# EAGLE design uc4h cube carrier v0310r (EAGLE 7.5.0)
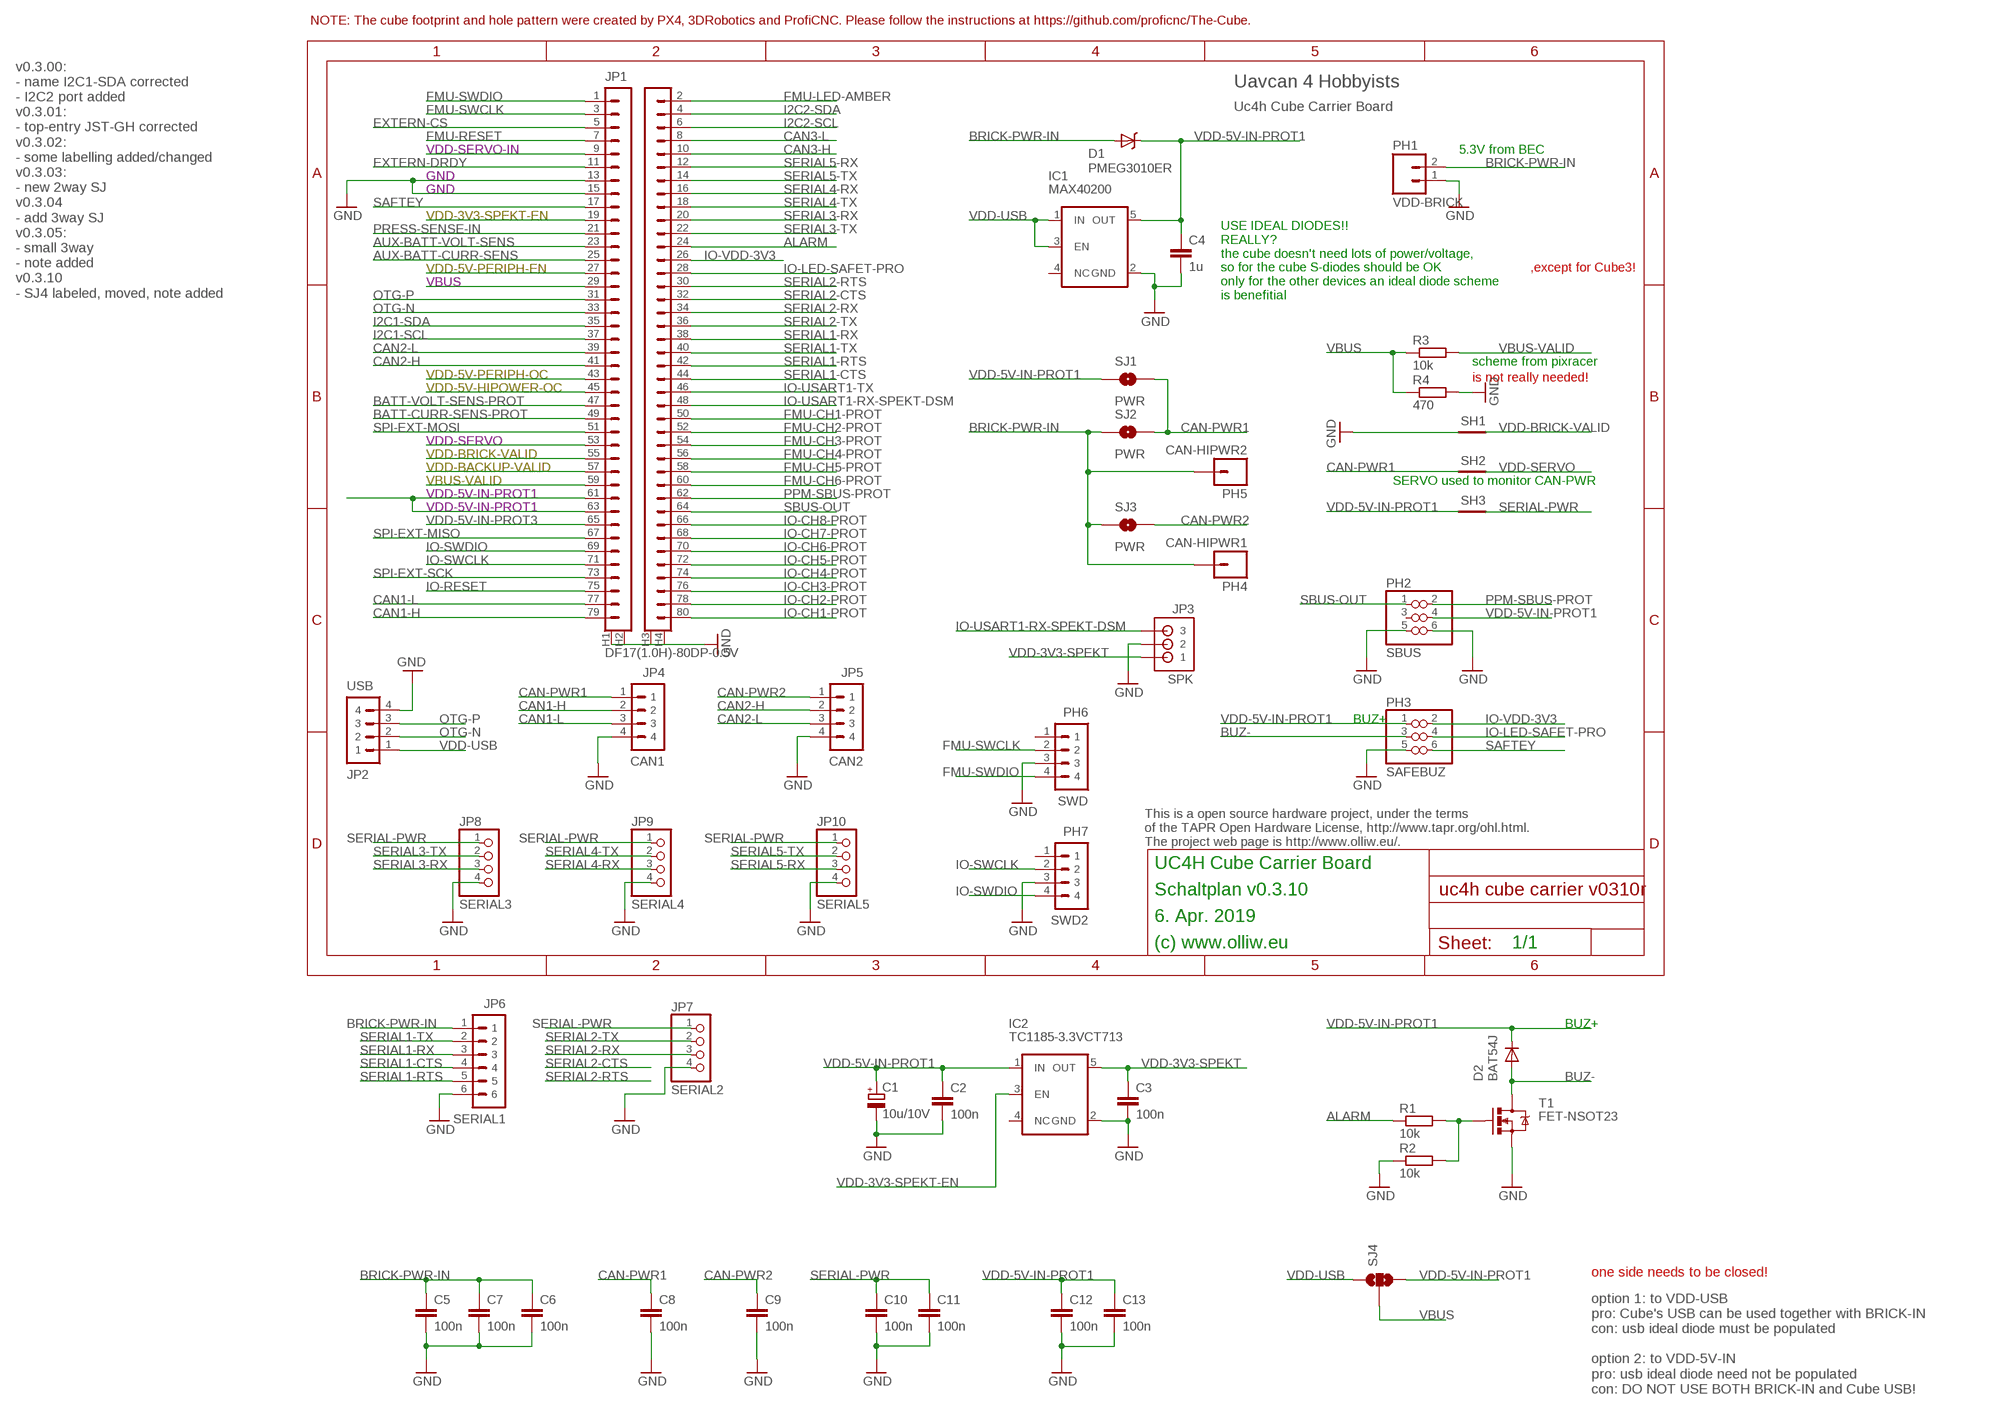
[diagram p0: schematic, sheet 1]

## Parts
C1  10u/10V  CPOL-EUSMCA  [SMC_A]
C2  100n  C-EUC0603  [C0603]
C3  100n  C-EUC0603  [C0603]
C4  1u  C-EUC0603  [C0603]
C5  100n  C-EUC0603  [C0603]
C6  100n  C-EUC0603  [C0603]
C7  100n  C-EUC0402  [C0402]
C8  100n  C-EUC0603  [C0603]
C9  100n  C-EUC0603  [C0603]
C10  100n  C-EUC0603  [C0603]
C11  100n  C-EUC0603  [C0603]
C12  100n  C-EUC0603  [C0603]
C13  100n  C-EUC0603  [C0603]
D1  PMEG3010ER  DIODE-SCHOTTKYSOD123-W  [SOD123W-DIODE]
D2  BAT54J  DIODE-SOD110-R  [SOD110-R]
IC1  MAX40200  V_REG_TPS76433SOT23-5  [SOT23-5]
IC2  TC1185-3.3VCT713  V_REG_TPS76433SOT23-5  [SOT23-5]
JP1  DF17(1.0H)-80DP-0.5V  PIX-CUBE-VIA  [PIX-CUBE-DF17(1.0H)-80DP-0.5V-VIA]
JP2  USB  JST-GH-4TOP-ENTRY  [BM04B-GHS-TBT]
JP3  SPK  B3B-ZR  [B3B-ZR]
JP4  CAN1  JST-GH-4TOP-ENTRY  [BM04B-GHS-TBT]
JP5  CAN2  JST-GH-4TOP-ENTRY  [BM04B-GHS-TBT]
JP6  SERIAL1  JST-GH-6TOP-ENTRY  [BM06B-GHS-TBT]
JP7  SERIAL2  PINHEAD_4X1  [PINHEAD_4X1]
JP8  SERIAL3  PINHEAD_4X1  [PINHEAD_4X1]
JP9  SERIAL4  PINHEAD_4X1  [PINHEAD_4X1]
JP10  SERIAL5  PINHEAD_4X1  [PINHEAD_4X1]
PH1  VDD-BRICK  M02PTH  [1X02]
PH2  SBUS  PINHEAD_3X2  [PINHEAD_3X2]
PH3  SAFEBUZ  PINHEAD_3X2  [PINHEAD_3X2]
PH4  CAN-HIPWR1  M01PTH  [1X01]
PH5  CAN-HIPWR2  M01PTH  [1X01]
PH6  SWD  P4X1_1P27-OCT_BILEX  [4X1_1P27_OCT_BILEX]
PH7  SWD2  P4X1_1P27-OCT_BILEX  [4X1_1P27_OCT_BILEX]
R1  10k  R-EU_R0402  [R0402]
R2  10k  R-EU_R0402  [R0402]
R3  10k  R-EU_R0402  [R0402]
R4  470  R-EU_R0402  [R0402]
SH1  SHORT-HT5  [SHORT_TOP-50]
SH2  SHORT-HT5  [SHORT_TOP-50]
SH3  SHORT-HT5  [SHORT_TOP-50]
SJ1  PWR  SJ-2WAY-WPASTECONNECT  [SJ-2WAY-BIG-WPASTEC]
SJ2  PWR  SJ-2WAY-STANDARD  [SJ-2WAY-BIG]
SJ3  PWR  SJ-2WAY-WPASTECONNECT  [SJ-2WAY-BIG-WPASTEC]
SJ4  SJ-3WAY-03  [SJ-3WAY-WPASTEC]
T1  FET-NSOT23  [SOT23]

## Nets
ALARM: JP1.24 R1.1
AUX-BATT-CURR-SENS: JP1.25
AUX-BATT-VOLT-SENS: JP1.23
BATT-CURR-SENS-PROT: JP1.49
BATT-VOLT-SENS-PROT: JP1.47
BRICK-PWR-IN: C5.1 C6.1 C7.1 D1.A JP6.1 PH1.2 PH4.1 PH5.1 SJ2.1 SJ3.1
BUZ-: D2.A PH3.3 T1.3(D)
CAN1-H: JP1.79 JP4.2
CAN1-L: JP1.77 JP4.3
CAN2-H: JP1.41 JP5.2
CAN2-L: JP1.39 JP5.3
CAN3-H: JP1.10
CAN3-L: JP1.8
CAN-PWR1: C8.1 JP4.1 SH2.1 SJ1.2 SJ2.2
CAN-PWR2: C9.1 JP5.1 SJ3.2
EXTERN-CS: JP1.5
EXTERN-DRDY: JP1.11
FMU-CH1-PROT: JP1.50
FMU-CH2-PROT: JP1.52
FMU-CH3-PROT: JP1.54
FMU-CH4-PROT: JP1.56
FMU-CH5-PROT: JP1.58
FMU-CH6-PROT: JP1.60
FMU-LED-AMBER: JP1.2
FMU-RESET: JP1.7
FMU-SWCLK: JP1.3 PH6.2
FMU-SWDIO: JP1.1 PH6.4
GND: C1.- C2.2 C3.2 C4.2 C5.2 C6.2 C7.2 C8.2 C9.2 C10.2 C11.2 C12.2 C13.2 IC1.2(GND) IC2.2(GND) JP1.13 JP1.15 JP1.H1 JP1.H2 JP1.H3 JP1.H4 JP2.4 JP3.2 JP4.4 JP5.4 JP6.6 JP7.4 JP8.4 JP9.4 JP10.4 PH1.1 PH2.5 PH2.6 PH3.5 PH6.3 PH7.3 R2.1 R4.2 SH1.1 T1.2(S)
I2C1-SCL: JP1.37
I2C1-SDA: JP1.35
I2C2-SCL: JP1.6
I2C2-SDA: JP1.4
IO-CH1-PROT: JP1.80
IO-CH2-PROT: JP1.78
IO-CH3-PROT: JP1.76
IO-CH4-PROT: JP1.74
IO-CH5-PROT: JP1.72
IO-CH6-PROT: JP1.70
IO-CH7-PROT: JP1.68
IO-CH8-PROT: JP1.66
IO-LED-SAFET-PRO: JP1.28 PH3.4
IO-RESET: JP1.75
IO-SWCLK: JP1.71 PH7.2
IO-SWDIO: JP1.69 PH7.4
IO-USART1-RX-SPEKT-DSM: JP1.48 JP3.3
IO-USART1-TX: JP1.46
IO-VDD-3V3: JP1.26 PH3.2
N$1: R1.2 R2.2 T1.1(G)
OTG-N: JP1.33 JP2.2
OTG-P: JP1.31 JP2.3
PPM-SBUS-PROT: JP1.62 PH2.2
PRESS-SENSE-IN: JP1.21
SAFTEY: JP1.17 PH3.6
SBUS-OUT: JP1.64 PH2.1
SERIAL1-CTS: JP1.44 JP6.4
SERIAL1-RTS: JP1.42 JP6.5
SERIAL1-RX: JP1.38 JP6.3
SERIAL1-TX: JP1.40 JP6.2
SERIAL2-CTS: JP1.32
SERIAL2-RTS: JP1.30
SERIAL2-RX: JP1.34 JP7.3
SERIAL2-TX: JP1.36 JP7.2
SERIAL3-RX: JP1.20 JP8.3
SERIAL3-TX: JP1.22 JP8.2
SERIAL4-RX: JP1.16 JP9.3
SERIAL4-TX: JP1.18 JP9.2
SERIAL5-RX: JP1.12 JP10.3
SERIAL5-TX: JP1.14 JP10.2
SERIAL-PWR: C10.1 C11.1 JP7.1 JP8.1 JP9.1 JP10.1 SH3.2
SPI-EXT-MISO: JP1.67
SPI-EXT-MOSI: JP1.51
SPI-EXT-SCK: JP1.73
VBUS: JP1.29 R3.1 R4.1 SJ4.2
VBUS-VALID: JP1.59 R3.2
VDD-3V3-SPEKT: C3.1 IC2.5(OUT) JP3.1
VDD-3V3-SPEKT-EN: IC2.3(EN) JP1.19
VDD-5V-HIPOWER-OC: JP1.45
VDD-5V-IN-PROT1: C1.+ C2.1 C4.1 C12.1 C13.1 D1.C D2.C IC1.5(OUT) IC2.1(IN) JP1.61 JP1.63 PH2.4 PH3.1 SH3.1 SJ1.1 SJ4.3
VDD-5V-IN-PROT3: JP1.65
VDD-5V-PERIPH-EN: JP1.27
VDD-5V-PERIPH-OC: JP1.43
VDD-BACKUP-VALID: JP1.57
VDD-BRICK-VALID: JP1.55 SH1.2
VDD-SERVO: JP1.53 SH2.2
VDD-SERVO-IN: JP1.9
VDD-USB: IC1.1(IN) IC1.3(EN) JP2.1 SJ4.1
Unconnected: IC1.4(NC) IC2.4(NC) PH2.3 PH6.1 PH7.1

## Notes on the sheet
- NOTE: The cube footprint and hole pattern were created by PX4, 3DRobotics and ProfiCNC. Please follow the instructions at https://github.com/proficnc/The-Cube.
- v0.3.00:
  - name I2C1-SDA corrected
  - I2C2 port added
  v0.3.01:
  - top-entry JST-GH corrected
  v0.3.02:
  - some labelling added/changed
  v0.3.03:
  - new 2way SJ
  v0.3.04
  - add 3way SJ
  v0.3.05:
  - small 3way
  - note added
  v0.3.10
  - SJ4 labeled, moved, note added
- Uavcan 4 Hobbyists
- Uc4h Cube Carrier Board
- 5.3V from BEC
- ,except for Cube3!
- USE IDEAL DIODES!!
  REALLY?
  the cube doesn't need lots of power/voltage,
  so for the cube S-diodes should be OK
  only for the other devices an ideal diode scheme
  is benefitial
- scheme from pixracer
- is not really needed!
- SERVO used to monitor CAN-PWR
- BUZ+
- This is a open source hardware project, under the terms
  of the TAPR Open Hardware License, http://www.tapr.org/ohl.html.
  The project web page is http://www.olliw.eu/.
- UC4H Cube Carrier Board
- Schaltplan v0.3.10
- 6. Apr. 2019
- (c) www.olliw.eu | 1/1
- BUZ+
- one side needs to be closed!
- option 1: to VDD-USB
  pro: Cube's USB can be used together with BRICK-IN
  con: usb ideal diode must be populated
  
  option 2: to VDD-5V-IN
  pro: usb ideal diode need not be populated
  con: DO NOT USE BOTH BRICK-IN and Cube USB!

## Library data of the parts
C1 = rcl:CPOL-EU: POLARIZED CAPACITOR, European symbol
C2-C13 = rcl:C-EU: CAPACITOR, European symbol
D1 = # stdlib:DIODE-SCHOTTKY
D2 = diode:DIODE-: DIODE
IC1 IC2 = # SparkFun2:V_REG_TPS76433: Voltage Regulator Older TI part. LDO 150mA regulator. No output by-pass cap option. See V_REG_LDO for a better part.
JP1 = # stdlib:PIX-CUBE
JP2 JP4 JP5 = # stdlib:JST-GH-4
JP3 = # jst:B3B-ZR: JST-ZH Connector 3 pol, 1.5mm pitch Package: B3B-ZR Source: http://www.jst-mfg.com/product/pdf/eng/eZH.pdf
JP6 = # stdlib:JST-GH-6
JP7-JP10 = # stdlib:PINHEAD_4X1
PH1 = # SparkFun2:M02: Header 2 Standard 2-pin 0.1" header. Use with straight break away headers (SKU : PRT-00116), right angle break away headers (PRT-00553), swiss pins (PRT-00743), machine pins (PRT-00117), and female headers (PRT-00115). Molex polarized connector foot print use with SKU : PRT-08233 with associated crimp pins and housings.
PH2 PH3 = # stdlib:PINHEAD_3X2
PH4 PH5 = # SparkFun:M01: Header 1 Standard 1-pin 0.1" header. Use with straight break away headers (SKU : PRT-00116), right angle break away headers (PRT-00553), swiss pins (PRT-00743), machine pins (PRT-00117), and female headers (PRT-00115).
PH6 PH7 = # stdlib:P4X1_1P27
R1-R4 = rcl:R-EU_: RESISTOR, European symbol
SH1-SH3 = shorts:SHORT-H: Short between two nets; BOM: no
SJ1-SJ3 = # stdlib:SJ-2WAY
SJ4 = # stdlib:SJ-3WAY
T1 = # stdlib:FET-N

## Board
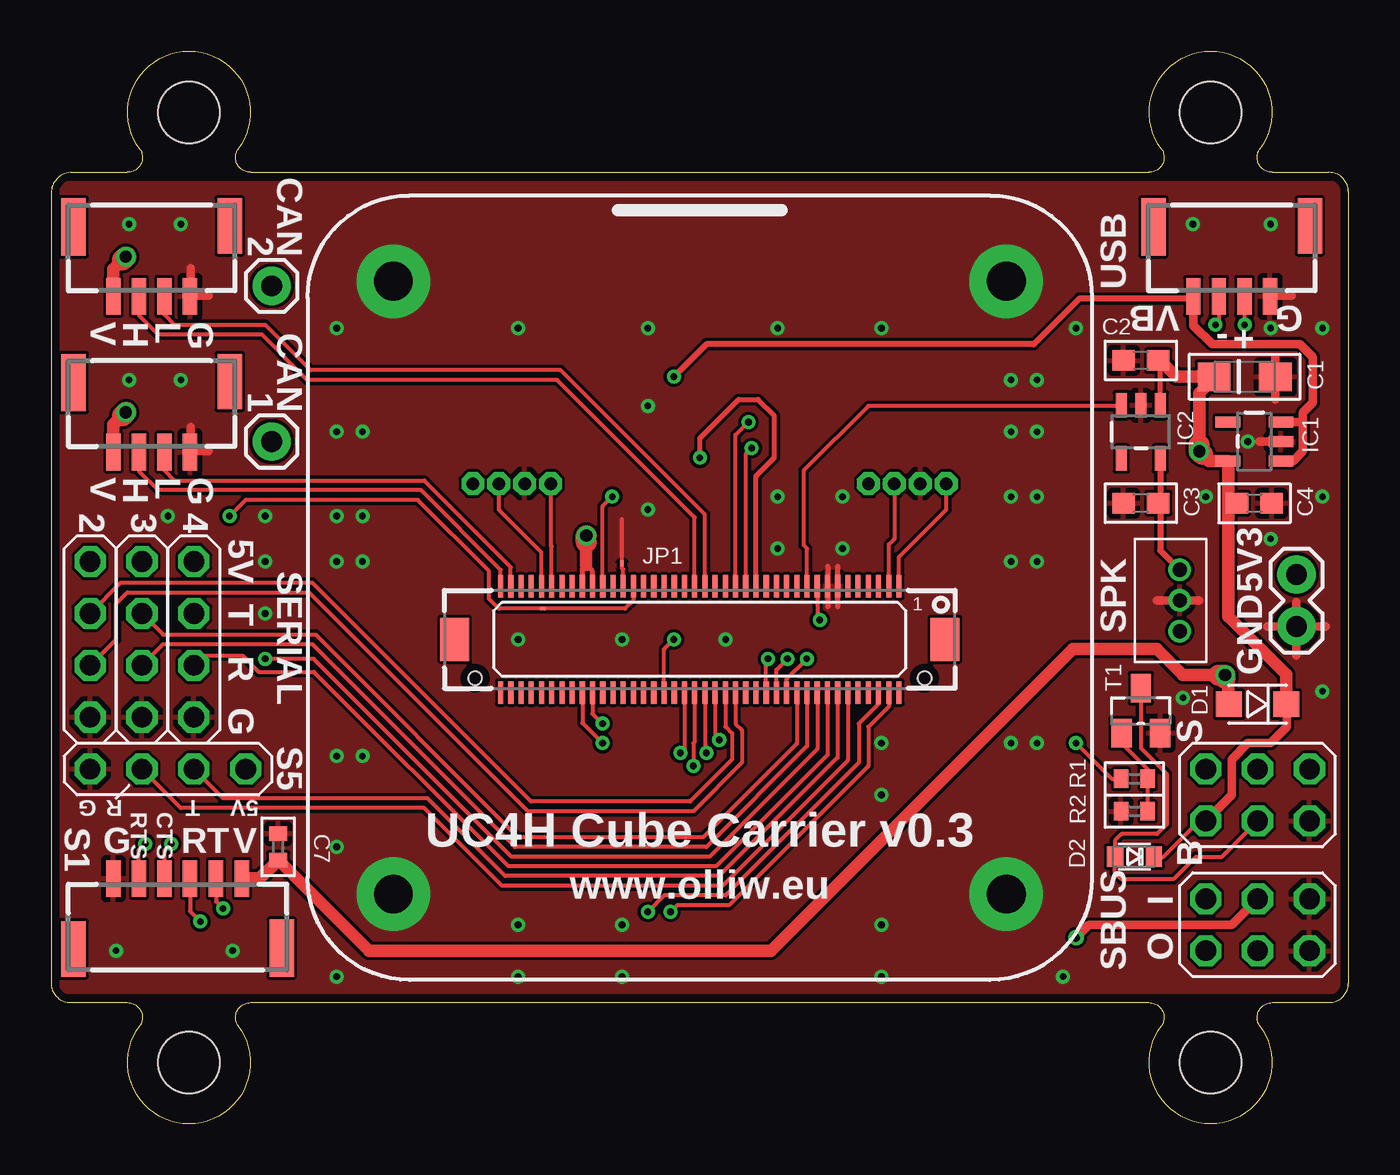
[diagram p1: board, top side]
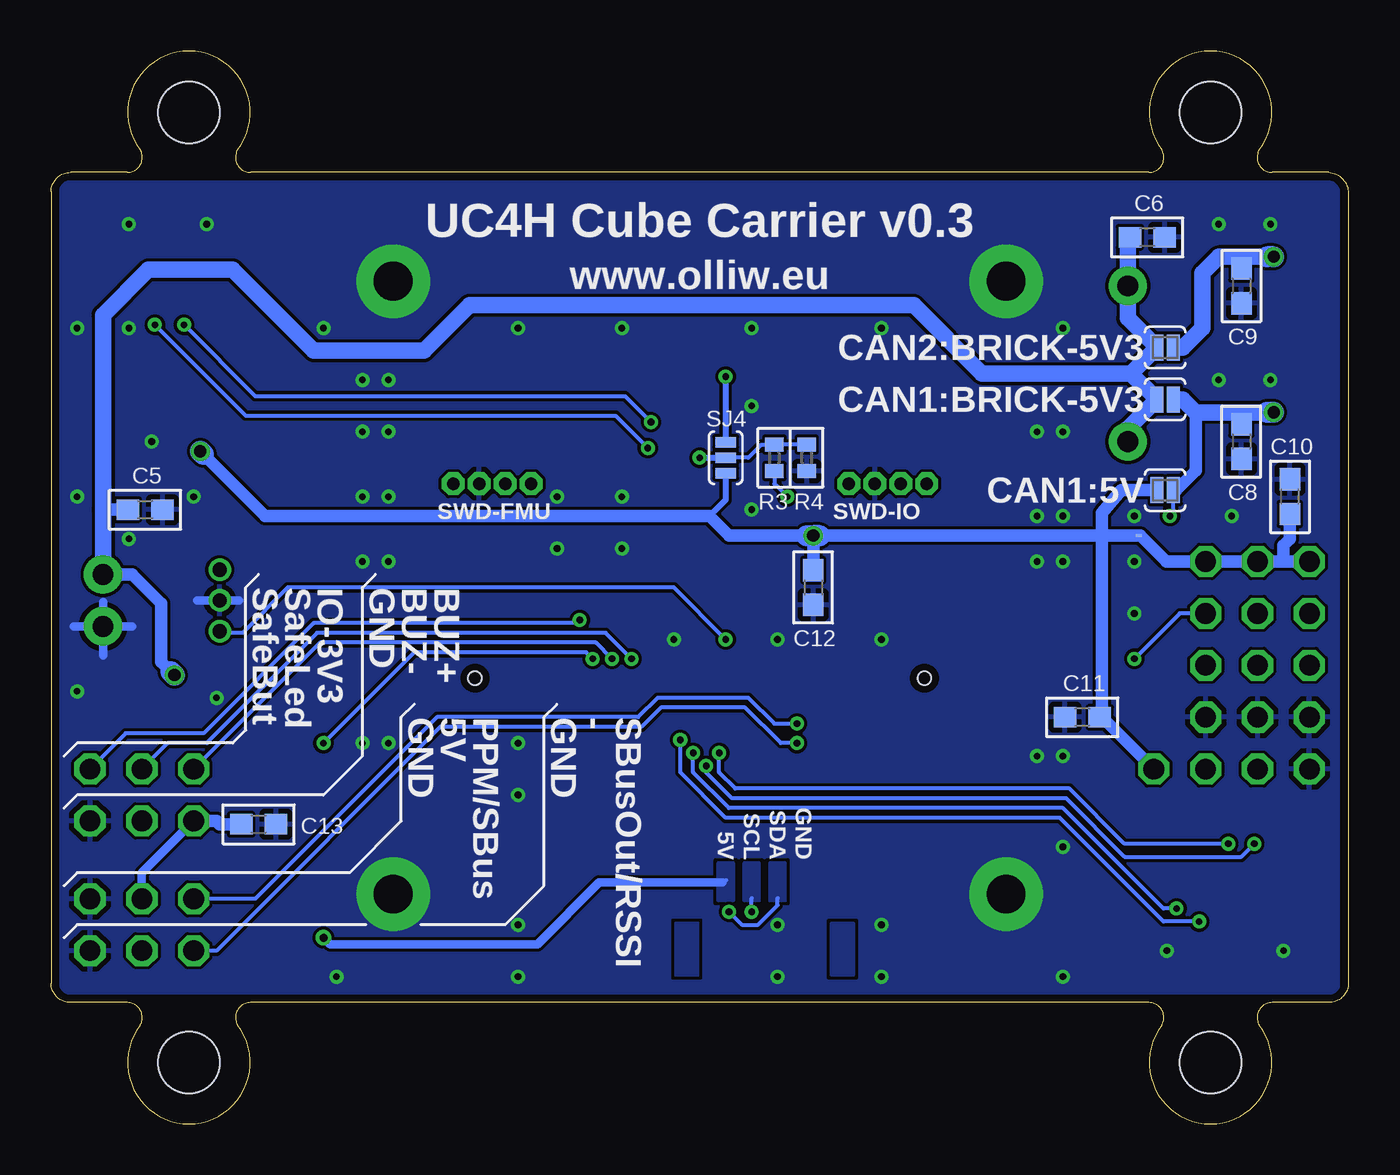
[diagram p2: board, bottom side, seen from below]

Size 63.5 x 52.51 mm. Coordinates in mm from the lower left corner, seen from the top.
Outline: 0.95,5.94 3.73,5.94 arc-120 4.37,4.83 arc255 9.13,4.83 arc-120 9.77,5.94 53.74,5.94 arc-120 54.37,4.83 arc255 59.14,4.83 arc-120 59.77,5.94 62.55,5.94 arc90 63.5,6.89 63.5,45.62 arc90 62.55,46.58 59.77,46.58 arc-120 59.14,47.69 arc255 54.37,47.69 arc-120 53.74,46.58 9.77,46.58 arc-120 9.13,47.69 arc255 4.37,47.69 arc-120 3.73,46.58 0.95,46.58 arc90 0,45.47 0,6.89 arc90 0.95,5.94
Copper layers (1*16): Top 0.0356mm / dielectric 1.5011mm / Bottom 0.0356mm
Design rules "ow-oshpark-2layer": minimum track width 6mil, minimum drill 13mil, track to track 6mil, track to pad 6mil, pad to pad 6mil, via to via 6mil, smd to smd 6mil, copper to edge 15mil, drill to drill 6mil, minimum pad ring 7mil, minimum via ring 7mil, stop-mask expansion 2.5mil, vias tented up to drill 26mil, thermal gap 10mil
Holes 3 mm at 6.75,49.51 56.76,49.51 56.76,3 6.75,3

### Footprints (pad centres in the part's own frame; a part is rotated, then mirrored left to right if it is on the bottom)
SMC_A = smd 1.6 x 1.4: + -1.5,0; - 1.5,0
C0603 = smd 1.1 x 1: 1 -0.85,0; 2 0.85,0
C0402 = smd 0.7 x 0.9: 1 -0.65,0; 2 0.65,0
SOD123W-DIODE = smd 1.27 x 1.27: A -1.4,0; C 1.4,0
SOD110-R = smd 0.8 x 1: A 0.95,0; C -0.95,0
SOT23-5 = smd 0.55 x 1.2: 1 -0.95,-1.3; 2 0,-1.3; 3 0.95,-1.3; 4 0.95,1.3; 5 -0.95,1.3
PIX-CUBE-DF17(1.0H)-80DP-0.5V-VIA = smd 0.25 x 1.1: 1 9.75,2.6; 2 9.75,-2.6; 3 9.25,2.6; 4 9.25,-2.6; 5 8.75,2.6; 6 8.75,-2.6; 7 8.25,2.6; 8 8.25,-2.6; 9 7.75,2.6; 10 7.75,-2.6; 11 7.25,2.6; 12 7.25,-2.6; 13 6.75,2.6; 14 6.75,-2.6; 15 6.25,2.6; 16 6.25,-2.6; 17 5.75,2.6; 18 5.75,-2.6; 19 5.25,2.6; 20 5.25,-2.6; 21 4.75,2.6; 22 4.75,-2.6; 23 4.25,2.6; 24 4.25,-2.6; 25 3.75,2.6; 26 3.75,-2.6; 27 3.25,2.6; 28 3.25,-2.6; 29 2.75,2.6; 30 2.75,-2.6; 31 2.25,2.6; 32 2.25,-2.6; 33 1.75,2.6; 34 1.75,-2.6; 35 1.25,2.6; 36 1.25,-2.6; 37 0.75,2.6; 38 0.75,-2.6; 39 0.25,2.6; 40 0.25,-2.6; 41 -0.25,2.6; 42 -0.25,-2.6; 43 -0.75,2.6; 44 -0.75,-2.6; 45 -1.25,2.6; 46 -1.25,-2.6; 47 -1.75,2.6; 48 -1.75,-2.6; 49 -2.25,2.6; 50 -2.25,-2.6; 51 -2.75,2.6; 52 -2.75,-2.6; 53 -3.25,2.6; 54 -3.25,-2.6; 55 -3.75,2.6; 56 -3.75,-2.6; 57 -4.25,2.6; 58 -4.25,-2.6; 59 -4.75,2.6; 60 -4.75,-2.6; 61 -5.25,2.6; 62 -5.25,-2.6; 63 -5.75,2.6; 64 -5.75,-2.6; 65 -6.25,2.6; 66 -6.25,-2.6; 67 -6.75,2.6; 68 -6.75,-2.6; 69 -7.25,2.6; 70 -7.25,-2.6; 71 -7.75,2.6; 72 -7.75,-2.6; 73 -8.25,2.6; 74 -8.25,-2.6; 75 -8.75,2.6; 76 -8.75,-2.6; 77 -9.25,2.6; 78 -9.25,-2.6; 79 -9.75,2.6; 80 -9.75,-2.6 | drill 1.9 pad 3.6: H1 -15,17.53; H2 -15,-12.47; H3 15,-12.47; H4 15,17.53 | smd 1.4 x 2.1: SIT1 12,0; SIT2 -12,0 | hole 0.65: -11,-1.9; 11,-1.9
BM04B-GHS-TBT = smd 0.7 x 1.8: 1 1.875,4.8; 2 0.625,4.8; 3 -0.625,4.8; 4 -1.875,4.8 | smd 1.2 x 2.7: FIT@1 -3.825,1.35 | smd 1.2 x 2.8: FIT@2 3.825,1.4
B3B-ZR = drill 0.7 pad 1.1: 1 -1.5,0; 2 0,0; 3 1.5,0
BM06B-GHS-TBT = smd 0.7 x 1.8: 1 3.145,4.8; 2 1.875,4.8; 3 0.605,4.8; 4 -0.645,4.8; 5 -1.895,4.8; 6 -3.145,4.8 | smd 1.2 x 2.7: FIT@1 -5.095,1.35 | smd 1.2 x 2.8: FIT@2 5.095,1.4
PINHEAD_4X1 = drill 1.016 octagon: 1 0,7.62; 2 0,5.08; 3 0,2.54; 4 0,0
1X02 = drill 1.016 pad 1.88: 1 0,0; 2 2.54,0
PINHEAD_3X2 = drill 1.016 octagon: 1 0,0; 2 2.54,0; 3 0,-2.54; 4 2.54,-2.54; 5 0,-5.08; 6 2.54,-5.08
1X01 = drill 1.016 pad 1.88: 1 0,0
4X1_1P27_OCT_BILEX = drill 0.61 pad 1.118 octagon: 1 0,0; 2 0,-1.27; 3 0,-2.54; 4 0,-3.81
R0402 = smd 0.7 x 0.9: 1 -0.65,0; 2 0.65,0
SHORT_TOP-50 = smd 0.152 x 0.152: 1 0,0; 2 0.127,0
SJ-2WAY-BIG-WPASTEC = smd 0.635 x 1.27: 1 -0.4,0; 2 0.413,0
SJ-2WAY-BIG = smd 0.635 x 1.27: 1 -0.4,0; 2 0.413,0
SJ-3WAY-WPASTEC = smd 0.508 x 1.016: 1 -0.762,0; 2 0,0; 3 0.762,0
SOT23 = smd 1 x 1.4: 1 -0.95,-1.1; 2 0.95,-1.1; 3 0,1.1

### Placement (x,y rotation side)
C1  58.42,36.58 0 top
C2  53.34,37.37 180 top
C3  53.34,30.38 180 top
C4  58.9,30.38 0 top
C5  58.9,30.07 0 bottom
C6  9.85,43.4 0 bottom
C7  11.12,13.56 90 top
C8  5.24,33.4 270 bottom
C9  5.24,41.02 270 bottom
C10  2.86,30.7 90 bottom
C11  13.02,19.91 180 bottom
C12  26.2,26.26 270 bottom
C13  53.34,14.67 0 bottom
D1  59.06,20.54 0 top
D2  53.03,13.08 180 top
IC1  58.9,33.4 90 top
IC2  53.34,33.88 180 top
JP1  31.75,23.72 0 top
JP2  57.79,45.31 180 top
JP3  55.25,25.62 270 top
JP4  4.92,37.69 180 top
JP5  4.92,45.31 180 top
JP6  6.19,7.21 0 top
JP7  1.91,19.91 0 top
JP8  4.45,19.91 0 top
JP9  6.99,19.91 0 top
JP10  1.91,17.37 270 top
PH1  60.96,24.35 90 top
PH2  56.52,8.48 90 top
PH3  56.52,14.83 90 top
PH4  10.8,33.4 0 top
PH5  10.8,41.02 0 top
PH6  40.01,31.34 90 top
PH7  20.64,31.34 90 top
R1  53.03,16.89 0 top
R2  53.03,15.3 0 top
R3  28.1,32.61 270 bottom
R4  26.51,32.61 270 bottom
SH1  27.94,27.37 90 top
SH2  24.13,25.23 180 top
SH3  10.32,28.8 0 bottom
SJ1  8.97,31.02 0 bottom
SJ2  8.97,35.46 0 bottom
SJ3  8.97,38 0 bottom
SJ4  30.48,32.61 270 bottom
T1  53.34,20.22 0 top

### Tracks (layer width: path | path; a pad name or v marks a point on that pad's centre or on a via)
ALARM  (via drill 0.33)
  Top 0.203: JP1.24 36,21.78 v36.99,22.77 | v50.17,18.64 51.91,16.89 R1.1
  Bottom 0.203: v36.99,22.77 37.31,23.08 45.72,23.08 v50.17,18.64
BRICK-PWR-IN  (via drill 0.6)
  Top 0.61: 57.47,21.81 57.63,21.65 57.63,21.05 D1.A | 57.15,21.97 55.41,21.97 54.14,23.24 50.01,23.24 35.25,8.48 15.56,8.48 11.12,12.92 C7.1 10.21,12.01 JP6.1
  Top 1.016: 57.15,21.97 v57.47,21.97 57.47,21.81
  Bottom 0.406: 9.53,37.85 SJ3.1 9.51,37.69 9.53,38.16 | 9.53,35.62 SJ2.1 9.53,35.31 | 10.8,43.14 C6.1
  Bottom 0.61: PH1.2 59.53,26.89 58.11,25.46 58.11,22.61 57.63,22.13 | C5.1 60.96,30.07
  Bottom 0.813: 10.64,36.73 17.94,36.73 21.28,40.07 43.02,40.07 45.25,37.85 50.64,37.85 54.61,41.82 58.74,41.82 60.96,39.59 60.96,30.07 PH1.2 | 9.53,37.85 10.64,36.73 | 9.53,35.62 10.64,36.73 | 9.53,38.16 10.8,39.43 PH5.1 10.8,43.14 | PH4.1 10.8,34.04 9.53,35.31
  Bottom 1.016: 57.63,22.13 v57.47,21.97
BUZ-
  Top 0.203: PH3.3 57.31,13.08 56.04,13.08 54.93,11.97 52.39,11.97 52.07,12.29 52.07,12.92 D2.A 52.07,12.92 52.07,13.87 52.39,14.19 54.14,14.19 54.61,14.67 54.61,17.13 53.34,18.4 T1.3
CAN1-H
  Top 0.203: JP1.79 22,27.12 18.1,31.02 5.24,31.02 4.3,31.96 JP4.2
CAN1-L
  Top 0.203: JP1.77 22.5,27.25 18.26,31.5 6.03,31.5 5.55,31.98 JP4.3
CAN2-H
  Top 0.203: JP1.41 31.5,29.68 24.77,36.42 12.54,36.42 10.32,38.64 5.24,38.64 4.3,39.58 JP5.2
CAN2-L
  Top 0.203: JP1.39 32,29.82 24.93,36.89 12.7,36.89 10.48,39.12 6.03,39.12 5.55,39.6 JP5.3
CAN-PWR1  (via drill 0.33, 0.6)
  Top 0.203: SH2.1 21.91,25.23 21.43,25.7 21.43,27.05 17.94,30.54 9.53,30.54 v8.73,29.75
  Top 0.61: JP4.1 3.05,34.22 v3.65,34.83
  Top 1.016: 3.5,34.67 v3.65,34.83
  Bottom 0.203: v8.73,29.75 8.57,29.91 8.57,31 SJ1.2
  Bottom 0.406: SJ2.2 8.42,35.47 | 8.43,31.02 SJ1.2
  Bottom 0.61: 8.43,31.02 8.42,31.02 7.46,31.97 7.46,34.83 | C8.1 5.24,34.83
  Bottom 0.813: 8.42,35.47 8.1,35.47 7.46,34.83 5.24,34.83 3.97,34.83
  Bottom 1.016: v3.65,34.83 3.97,34.83
CAN-PWR2  (via drill 0.6)
  Top 0.61: JP5.1 3.05,41.85 v3.65,42.45
  Top 1.016: 3.5,42.29 v3.65,42.45
  Bottom 0.406: 8.42,38.01 SJ3.2
  Bottom 0.61: C9.1 5.24,42.45
  Bottom 0.813: 8.42,38.01 8.1,38.01 7.15,38.96 7.15,41.66 6.35,42.45 5.24,42.45 3.97,42.45
  Bottom 1.016: v3.65,42.45 3.97,42.45
FMU-SWCLK
  Top 0.203: JP1.3 41,28.36 41.28,28.64 PH6.2
FMU-SWDIO
  Top 0.203: JP1.1 41.5,27.75 43.82,30.07 PH6.4
GND  (via drill 0.33)
  Top 0.203: SH1.1 27.94,29.59
  Top 0.254: 38.5,27.29 38.5,25.31 | 38.02,27.29 38.02,25.31
  Top 0.406: 59.53,24.35 62.39,24.35 | 60.96,22.92 60.96,25.54 | 60.09,33.4 59.14,33.4 | 59.93,35.47 59.93,37.53 | 54.14,25.62 56.2,25.62 | 59.77,40.54 60.72,40.54 | 7.7,40.54 6.75,40.54 | 6.75,32.93 7.7,32.93 | 6.83,33.16 6.83,34.12 | 6.83,41.89 6.83,40.94
  Bottom 0.406: 59.53,24.35 62.39,24.35 | 60.96,22.92 60.96,25.54 | 54.29,25.62 56.36,25.62
  other vias: 49.53,7.21 62.23,21.18 62.23,30.7 56.52,30.7 55.41,20.86 40.64,9.75 40.64,16.1 40.64,18.64 38.74,30.7 48.26,30.7 48.26,27.53 38.74,28.16 33.02,23.72 27.94,23.72 22.86,23.72 29.21,30.07 15.24,29.75 15.24,33.88 29.21,35.15 29.21,38.96 13.97,38.96 50.17,38.96 40.64,38.96 27.94,9.75 22.86,9.75 15.24,27.53 22.86,7.21 27.94,7.21 40.64,7.21 13.97,7.21 48.26,18.64 13.97,33.88 13.97,29.75 13.97,27.53 3.81,44.04 3.81,36.42 15.24,18 13.97,18 13.97,13.56 35.56,30.7 22.86,38.96 10.48,24.99 10.48,29.75 5.72,29.75 6.35,44.04 6.35,36.42 48.26,33.88 10.48,27.53 35.56,28.16 46.99,33.88 46.99,30.7 46.99,27.53 59.69,28.64 58.58,33.4 62.23,38.96 35.56,38.96 59.69,44.04 55.88,44.04 46.99,36.42 48.26,36.42 46.99,18.64 59.69,38.96 8.89,8.48 3.18,8.48
  pour Bottom (isolate 0.152, rank 6): 0.48,46.1 63.03,46.1 63.03,6.41 0.48,6.41
  pour Top (isolate 0.152, rank 6): 0.48,46.1 63.03,46.1 63.03,6.41 0.48,6.41
I2C2-SCL  (via drill 0.33)
  Top 0.203: JP1.6 40.5,20.56 39.53,19.59 39.53,17.68 33.02,11.18 30.01,11.18 v29.21,10.38
  Bottom 0.203: v29.21,10.38 29.21,11.04
  pour Bottom: 29.61,12.76 29.61,10.94 28.82,10.94 28.82,12.76
I2C2-SDA  (via drill 0.33)
  Top 0.203: JP1.4 41,20.43 40.01,19.43 40.01,17.53 33.18,10.7 30.64,10.7 v30.32,10.38
  Bottom 0.203: v30.32,10.38 29.69,9.75 28.89,9.75 27.94,10.7 27.94,11.04
  pour Bottom: 27.55,12.76 28.34,12.76 28.34,10.94 27.55,10.94
IO-LED-SAFET-PRO  (via drill 0.33)
  Top 0.203: JP1.28 35,22.68 v35.09,22.77
  Bottom 0.203: v35.09,22.77 36.36,24.04 50.49,24.04 55.88,18.64 57.79,18.64 PH3.4
IO-SWCLK
  Top 0.203: JP1.71 24,27.97 21.91,30.07 PH7.2
IO-SWDIO
  Top 0.203: JP1.69 24.5,28.27 24.45,28.32 PH7.4
IO-USART1-RX-SPEKT-DSM  (via drill 0.33)
  Top 0.203: JP1.48 30,23.24 v30.48,23.72
  Bottom 0.203: v30.48,23.72 33.02,26.26 51.91,26.26 54.14,24.04 55.16,24.04 JP3.3
IO-VDD-3V3  (via drill 0.33)
  Top 0.203: JP1.26 35.5,22.23 v36.04,22.77
  Bottom 0.203: v36.04,22.77 36.83,23.56 50.33,23.56 PH3.2
N$1
  Top 0.203: R2.2 R1.2 53.67,17.35 52.39,18.63 T1.1
N$2
  pour Bottom: 24.21,9.83 25.32,9.83 25.32,7.29 24.21,7.29
N$3
  pour Bottom: 31.83,9.83 32.94,9.83 32.94,7.29 31.83,7.29
OTG-N  (via drill 0.33)
  Top 0.203: JP1.33 33.5,33.72 v34.14,34.36 | JP2.2 57.16,39.29 v56.99,39.12
  Bottom 0.203: v56.99,39.12 53.5,35.62 35.4,35.62 v34.14,34.36
OTG-P  (via drill 0.33)
  Top 0.203: JP1.31 34,32.79 v34.29,33.08 | JP2.3 v58.41,39.13 v58.42,39.12
  Bottom 0.203: v58.42,39.12 53.98,34.67 35.88,34.67 v34.29,33.08
PPM-SBUS-PROT  (via drill 0.33)
  Top 0.203: JP1.62 26.5,20.08 v26.99,19.59
  Bottom 0.203: v26.99,19.59 28.1,19.59 29.37,20.86 33.82,20.86 34.77,19.91 44.61,19.91 53.5,11.02 PH2.2
SAFTEY  (via drill 0.33)
  Top 0.203: JP1.17 37.5,24.79 v37.63,24.67
  Bottom 0.203: PH3.6 59.85,19.11 56.04,19.11 50.64,24.51 37.78,24.51 v37.63,24.67
SBUS-OUT  (via drill 0.33)
  Top 0.203: v26.99,18.64 26,19.63 JP1.64
  Bottom 0.203: v26.99,18.64 27.78,18.64 29.53,20.38 33.66,20.38 34.61,19.43 44.45,19.43 55.41,8.48 PH2.1
SERIAL1-CTS  (via drill 0.33)
  Top 0.203: JP1.44 31,18.36 v30.8,18.16 | JP6.4 5.55,13.39 v5.88,13.72
  Bottom 0.203: v30.8,18.16 30.8,17.21 30.01,16.42 13.66,16.42 10.96,13.72 v5.88,13.72
SERIAL1-RTS  (via drill 0.33)
  Top 0.203: JP1.42 31.5,18.7 31.43,18.64 v31.43,17.53 | JP6.5 4.3,13.41 v4.61,13.72
  Bottom 0.203: v31.43,17.53 31.43,17.21 30.17,15.94 13.81,15.94 10.96,13.08 5.24,13.08 v4.61,13.72
SERIAL1-RX  (via drill 0.33)
  Top 0.203: JP1.38 32.5,19 v32.71,18.8 | JP6.3 6.8,10.41 v7.3,9.91
  Bottom 0.203: v32.71,18.8 32.71,17.21 30.48,14.99 14.13,14.99 9.05,9.91 v7.3,9.91
SERIAL1-TX  (via drill 0.33)
  Top 0.203: JP1.40 32,18.25 v32.07,18.16 | JP6.2 8.07,10.89 v8.42,10.54
  Bottom 0.203: v32.07,18.16 32.07,17.21 30.32,15.46 13.97,15.46 9.05,10.54 v8.42,10.54
SERIAL2-RX
  Top 0.203: JP1.34 33.5,19.59 33.82,19.27 33.82,17.68 31.43,15.3 23.34,15.3 12.62,26.02 3.73,26.02 3.18,25.46 3.18,23.72 JP7.3
SERIAL2-TX
  Top 0.203: JP1.36 33,19.45 33.34,19.11 33.34,17.84 31.28,15.78 23.5,15.78 12.78,26.5 3.42,26.5 JP7.2
SERIAL3-RX
  Top 0.203: JP1.20 37,18.49 32.07,13.56 22.7,13.56 12.78,23.48 5.48,23.48 JP8.3
SERIAL3-TX
  Top 0.203: JP1.22 36.5,18.63 31.91,14.03 22.86,14.03 12.94,23.96 5.48,23.96 JP8.2
SERIAL4-RX
  Top 0.203: JP1.16 38,18.06 32.55,12.6 22.39,12.6 12.86,22.13 10.16,22.13 9.37,22.92 7.46,22.92 JP9.3
SERIAL4-TX  (via drill 0.33)
  Top 0.203: JP1.18 37.5,18.36 32.23,13.08 22.55,13.08 12.86,22.77 v10.48,22.77
  Bottom 0.203: JP9.2 8.26,24.99 v10.48,22.77
SERIAL5-RX
  Top 0.203: JP1.12 39,17.79 32.86,11.65 22.07,11.65 18.26,15.46 6.35,15.46 JP10.3
SERIAL5-TX
  Top 0.203: JP1.14 38.5,17.93 32.71,12.13 22.23,12.13 18.42,15.94 8.42,15.94 JP10.2
SERIAL-PWR
  Bottom 0.61: JP10.1 12.07,19.91 | 12.07,19.91 12.07,28.8 SH3.2 8.92,27.53 JP9.1 JP8.1 3.18,27.53 | C11.1 12.07,19.91 | C10.1 2.86,28.64 3.18,28.32 3.18,27.53 | 3.18,27.53 JP7.1
VBUS  (via drill 0.33)
  Top 0.254: JP1.29 34.5,31.71 35.4,32.61 35.4,34.67 34.61,35.47 33.66,35.47 31.75,33.56 v31.75,32.61
  Bottom 0.203: SJ4.2 29.37,32.61 28.74,33.24 28.12,33.24 R3.1 R4.1
  Bottom 0.305: v31.75,32.61 SJ4.2
VBUS-VALID  (via drill 0.33)
  Top 0.203: JP1.59 27,30.24 v27.47,30.7
  Bottom 0.203: R3.2 28.1,31.34 v27.47,30.7
VDD-3V3-SPEKT
  Top 0.254: C3.1 54.19,30.33 54.29,30.23
  Top 0.305: IC2.5 54.29,30.48 C3.1 | 54.29,30.23 54.29,28.08 JP3.1
VDD-3V3-SPEKT-EN
  Top 0.203: JP1.19 37,28.16 36.83,28.33 36.83,31.97 40.01,35.15 52.36,35.15 IC2.3
VDD-5V-IN-PROT1  (via drill 0.4, 0.6)
  Top 0.203: PH3.1 56.2,14.83 54.45,13.08 D2.C
  Top 0.254: IC2.1 54.29,37.27 C2.1 | JP1.63 26,27.18 26.2,27.37 26.5,27.06 JP1.61
  Top 0.305: C4.1 57.63,30.39
  Top 0.406: PH3.1 57.79,16.1 57.79,17.84 58.58,18.64 59.69,18.64 60.49,19.43 60.49,20.41 D1.C | v50.17,9.11 50.8,9.75 57.79,9.75 PH2.4
  Top 0.61: 56.94,36.27 C1.+ | C1.+ 56.83,36.33 56.83,36.42 56.2,35.78 56.2,33.24 | 26.2,27.37 26.2,28.48 | D1.C 60.46,22 57.63,24.83 57.63,30.39 57.63,32.42 IC1.5 56.67,32.45 v56.2,32.93 | C2.1 54.29,37.37 55.09,36.58 C1.+
  Top 1.016: 26.2,28.48 v26.2,28.8 | 56.2,33.24 v56.2,32.93 56.36,32.77
  Bottom 0.203: 30.45,11.94 30.64,11.81
  Bottom 0.305: SJ4.3 30.48,30.54 31.28,29.75
  Bottom 0.406: PH3.1 59.06,12.29 PH2.4 | SJ1.1 9.53,31.02 | 30.64,11.81 36.67,11.81 39.69,8.79 49.85,8.79 v50.17,9.11
  Bottom 0.61: C12.1 v26.2,28.8 | C13.1 55.25,14.67 55.41,14.83 PH3.1 | SH3.1 12.07,28.8 | 12.07,28.8 25.88,28.8 | 26.51,28.8 30.32,28.8 31.28,29.75 53.03,29.75 56.04,32.77 | 12.07,28.8 12.07,29.91 11.12,31.02 9.53,31.02
  Bottom 1.016: 25.88,28.8 v26.2,28.8 26.51,28.8 | v56.2,32.93 56.04,32.77
  pour Bottom: 30.09,12.76 30.88,12.76 30.88,10.94 30.09,10.94
VDD-BRICK-VALID
  Top 0.203: JP1.55 28,27.15 27.94,27.21 SH1.2
VDD-SERVO
  Top 0.203: JP1.53 28.5,25.63 28.1,25.23 SH2.2
VDD-USB  (via drill 0.33)
  Top 0.305: JP2.1 55.79,40.39 50.33,40.39 48.1,38.16 32.07,38.16 v30.48,36.58
  Top 0.406: JP2.1 55.91,39.09 56.83,38.16 61.12,38.16 61.76,37.53 61.76,35.31 61.28,34.83 61.28,34.35 | 61.28,34.35 61.28,32.93 60.8,32.45 IC1.1 | IC1.3 61.28,34.35
  Bottom 0.305: v30.48,36.58 SJ4.1

### Text on the board
tNames: 2 | CAN | USB | VB | G | V | H | L | G | - | + | 1 | CAN | V | H | L | G | 2 | 3 | 4 | 5V | SERIAL | 5V3 | T | SPK | R | GND | G | S5 | S | G | R | T | 5V | S1 | G | RTS | CTS | R | T | V | UC4H Cube Carrier v0.3 | B | www.olliw.eu | I | O | SBUS
bNames: UC4H Cube Carrier v0.3 | www.olliw.eu | CAN2:BRICK-5V3 | CAN1:BRICK-5V3 | CAN1:5V | SWD-IO | SWD-FMU | BUZ+ | BUZ- | GND | IO-3V3 | SafeLed | SafeBut | SBusOut/RSSI | - | GND | PPM/SBus | 5V | GND | GND | SDA | SCL | 5V